# Altium schematic sheet DSI_LCD.SchDoc: 4 inch DSI LCD board
size A4; Date: 9/24/2014; Author: P.A.; CompanyName: STMicroelectronics; Organization: Microcontrollers Division; Address1: 12, Rue Jules HOROWITZ; Address2: 38019 Grenoble; Address3: FRANCE; DocumentNumber: MB1189; Revision: B-07; SheetNumber: 7; SheetTotal: 12; Project: STM32F469I-DISCO
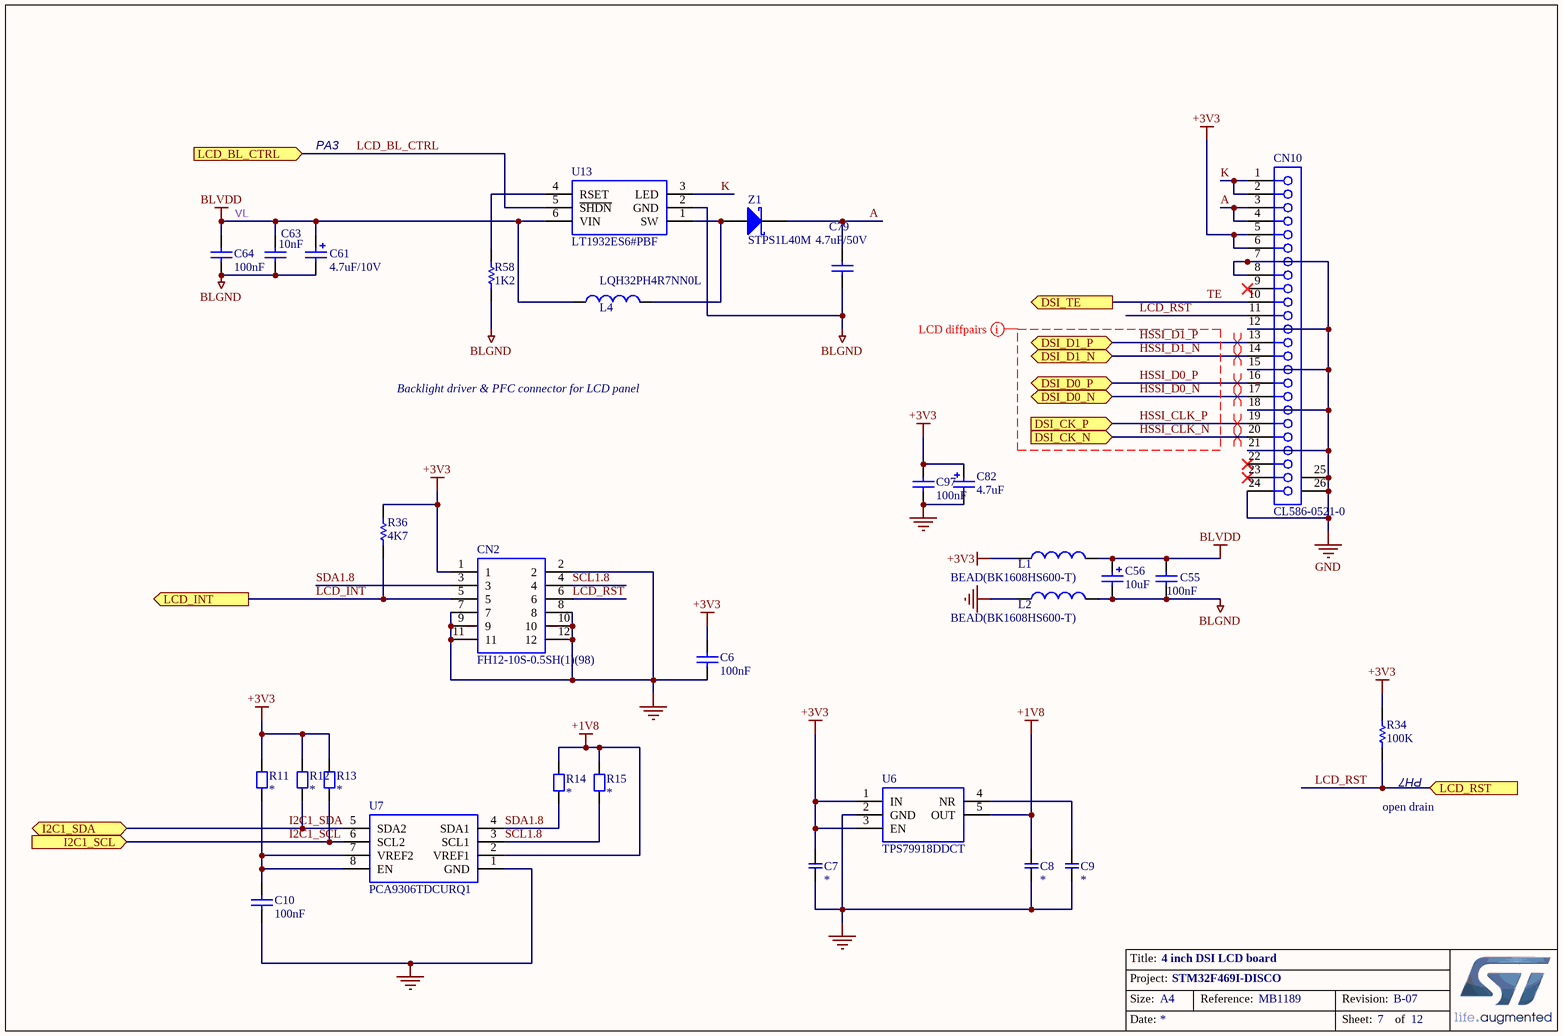
[diagram p0: DSI_LCD.SchDoc]

## Parts
C6  100nF  [CAP - 0402]
C7  100nF  [CAP - 0402]  (value not drawn)
C8  2.2uF  [CAP - 0402]  (value not drawn)
C9  10uF  [CAP - 0402]  (value not drawn)
C10  100nF  [CAP - 0402]
C55  100nF  [CAP - 0402]
C56  10uF  [A]
C61  4.7uF/10V  [CAP - 1206]
C63  10nF  [CAP - 0402]
C64  100nF  [CAP - 0402]
C79  4.7uF/50V  [CAP - 1206]
C82  4.7uF  [A]
C97  100nF  [CAP - 0402]
CN2  FH12-10S-0.5SH(1)(98)  [FH1210S05SH198]
CN10  CL586-0521-0  [FH12-24S-0.5SH]
L1  BEAD(BK1608HS600-T)  [1608[0603]]
L2  BEAD(BK1608HS600-T)  [1608[0603]]
L4  LQH32PH4R7NN0L  [C1210_L]
R11  200K  [RES - 0402]  (value not drawn)
R12  2K7  [RES - 0402]  (value not drawn)
R13  2K7  [RES - 0402]  (value not drawn)
R14  1K5  [RES - 0402]  (value not drawn)
R15  1K5  [RES - 0402]  (value not drawn)
R34  100K  [RES - 0402]
R36  4K7  [RES - 0402]
R58  1K2  [RES - 0402]
U6  TPS79918DDCT  [SOT95P280X110-5N]
U7  PCA9306TDCURQ1  [SOP50P310X90-8N]
U13  LT1932ES6#PBF  [SOT95P280X145-6N]
Z1  STPS1L40M  [DO-216AA]

## Ports
DSI_CK_N (in), DSI_CK_P (in), DSI_D0_N (bidir), DSI_D0_P (bidir), DSI_D1_N (bidir), DSI_D1_P (bidir), DSI_TE (out), I2C1_SCL (in), I2C1_SDA (bidir), LCD_BL_CTRL (in), LCD_INT (out), LCD_RST (in)

## Nets
+1V8: C8.2 R14.2 R15.2 U6.5(OUT) U7.2(VREF1)
+3V3: C6.2 C7.2 C82.1 C97.2 CN2.1 CN10.5 CN10.6 L1.1 R11.2 R12.2 R13.2 R34.1 R36.1 U6.1(IN) U6.3(EN)
BLGND: C55.2 C56.2 C61.2 C63.1 C64.1 C79.2 L2.2 R58.1 U13.2(GND)
GND: C6.1 C7.1 C8.1 C9.1 C10.1 C82.2 C97.1 CN2.2 CN2.7 CN2.8 CN2.9 CN2.10 CN2.11 CN2.12 CN10.7 CN10.8 CN10.12 CN10.15 CN10.18 CN10.21 CN10.24 CN10.25(MH1) CN10.26(MH2) L2.1 U6.2(GND) U7.1(GND)
VL: C55.1 C56.1 C61.1 C63.2 C64.2 L1.2 L4.1 U13.6(VIN)  [also labelled BLVDD]
A: C79.1 CN10.3 CN10.4 Z1.2(K)
HSSI_CLK_N: CN10.20 ; port DSI_CK_N
HSSI_CLK_P: CN10.19 ; port DSI_CK_P
HSSI_D0_N: CN10.17 ; port DSI_D0_N
HSSI_D0_P: CN10.16 ; port DSI_D0_P
HSSI_D1_N: CN10.14 ; port DSI_D1_N
HSSI_D1_P: CN10.13 ; port DSI_D1_P
I2C1_SCL: R13.1 U7.6(SCL2) ; port I2C1_SCL
I2C1_SDA: R12.1 U7.5(SDA2) ; port I2C1_SDA
K: CN10.1 CN10.2 U13.3(LED)
LCD_BL_CTRL: U13.5(~{SHDN}) ; port LCD_BL_CTRL
LCD_INT: CN2.5 R36.2 ; port LCD_INT
LCD_RST: CN2.6 CN10.11 R34.2 ; port LCD_RST
SCL1.8: CN2.4 R15.1 U7.3(SCL1)
SDA1.8: CN2.3 R14.1 U7.4(SDA1)
TE: CN10.10 ; port DSI_TE
NetC9_2: C9.2 U6.4(NR)
NetC10_2: C10.2 R11.1 U7.7(VREF2) U7.8(EN)
NetL4_2: L4.2 U13.1(SW) Z1.1(A)
NetR58_2: R58.2 U13.4(RSET)

Not connected (* = marked no-connect by the designer): CN10 9* 22* 23*

## Layout directives
differential pair: HSSI_CLK_N, HSSI_CLK_P, HSSI_D0_N, HSSI_D0_P, HSSI_D1_N, HSSI_D1_P
net class LCD: HSSI_CLK_N, HSSI_CLK_P, HSSI_D0_N, HSSI_D0_P, HSSI_D1_N, HSSI_D1_P

## Notes on the sheet
- PA3
- Backlight driver & PFC connector for LCD panel
- (near R34) PH7
- open drain
- Title:
- Project:
- Size:
- Date:
- A4
- Reference:
- Sheet:
- Revision:
- of

## Library data of the parts
C6 C10 C63 C64 C79 C97 = CAP: Capacitor; Value: 100pF; Ordered by: Subcon; Published: 8-Jun-2000; Revision: July-2002: Re-released for DXP Platform.; Publisher: Altium Limited
C7-C9 = capacitor: Parameter 1: *; Parameter 2: *; Value: *
C55 = Cap: Capacitor; Value: 10nF; Ordered by: Subcon; Published: 8-Jun-2000; Revision: July-2002: Re-released for DXP Platform.; Publisher: Altium Limited
C56 = Cap Pol1: Polarized Capacitor (Radial); Ordered by: Subcon; Published: 8-Jun-2000; Revision: July-2002: Re-released for DXP Platform.; Publisher: Altium Limited; Value: 10uF
C61 C82 = Cap Pol1: Polarized Capacitor (Radial); Value: 100pF; Ordered by: Subcon; Published: 8-Jun-2000; Revision: July-2002: Re-released for DXP Platform.; Publisher: Altium Limited
CN2 = FH12-10S-0.5SH(1)(98): FFC & FPC Connectors 10P SMT HORIZONTAL .5MM PITCH; Manufacturer_Name: Hirose; Geometry.Height: 2mm; Manufacturer_Part_Number: FH12-10S-0.5SH(1)(98); RS Part Number: *; RS Price/Stock: *; Arrow Part Number: FH12-10S-0.5SH(1)(98); Arrow Price/Stock: *; Datasheet Link: https://www.hirose.com/product/en/download_file/key_name/FH12-10S-0.5SH%281%29%2898%29/category/Drawing%20(2D)/doc_file_id/144497/?file_category_id=6&item_id=05280003598&is_series=
CN10 = CL586-0521-0: FH12 Series, "Flip-Lock" SMT/ZIF FFC/FPC Connector - 0.5mm Spaced Bottom Contact; Positions: 24; ContactMaterial: Phosphor Bronze; Current: 0.4A; PCB_Layout: Complies with manufacturer's recommendation.; Published: 17-Jul-2002; DatasheetVersion: 13-Nov-2000; PackageVersion: 13-Nov-2000; PackageReference: FH12-24S-0.5SH; Publisher: Altium Limited; PadDimensions: Follow nominal values, Suitable for Wave Soldering, Adjust for Re-flow.; ComponentLink1Description: Manufacturer Link; ComponentLink1URL: http://www.hiroseusa.com/; ComponentLink2Description: Datasheet; ComponentLink2URL: http://www.hirose.co.jp/cataloge_hp/e58605370.pdf
L1 L2 L4 = Inductor: Value: 100uH; Ordered by: Subcon; Published: 8-Jun-2000; Revision: July-2002: Re-released for DXP Platform.; Publisher: Altium Limited
R11-R15 = resistor: Parameter 1: *; Parameter 2: *; Value: *
R34 R36 R58 = Res1: Resistor; Value: 1K; Ordered by: Subcon; Published: 8-Jun-2000; Revision: July-2002: Re-released for DXP Platform.; Publisher: Altium Limited
U6 = TPS79918DDCT: TPS79918DDCT, Low Dropout Voltage Regulator, 0.2A, 1.8V 1%, 2.7 to 6.5Vin, 5-Pin SOT; Manufacturer_Name: Texas Instruments; Geometry.Height: 1.1mm; Manufacturer_Part_Number: TPS79918DDCT; RS Part Number: 1455973; RS Price/Stock: http://uk.rs-online.com/web/p/products/1455973; Mouser Part Number: 595-TPS79918DDCT; Mouser Price/Stock: https://www.mouser.com/Search/Refine.aspx?Keyword=595-TPS79918DDCT; Datasheet Link: http://www.ti.com/lit/ds/symlink/tps79918.pdf
U7 = PCA9306TDCURQ1: Automotive Dual Bidirectional I2C Bus and SMBus Voltage-Level Translator; Manufacturer_Name: Texas Instruments; Geometry.Height: 0.9mm; Manufacturer_Part_Number: PCA9306TDCURQ1; RS Part Number: *; RS Price/Stock: *; Mouser Part Number: 595-PCA9306TDCURQ1; Mouser Price/Stock: https://www.mouser.com/Search/Refine.aspx?Keyword=595-PCA9306TDCURQ1; Datasheet Link: http://www.ti.com/lit/gpn/pca9306-q1
U13 = LT1932ES6#PBF: LINEAR TECHNOLOGY - LT1932ES6#PBF - IC, DC/DC CONVERT/LED DR, 6SOT2; Geometry.Height: 1.45mm; Manufacturer_Name: Linear Technology; Manufacturer_Part_Number: LT1932ES6#PBF; RS Part Number: *; RS Price/Stock: *; Mouser Part Number: 584-LT1932ES6#PBF; Mouser Price/Stock: https://www.mouser.com/Search/Refine.aspx?Keyword=584-LT1932ES6%23PBF; Datasheet Link: http://www.linear.com/docs/2139
Z1 = D Schottky: Schottky Diode; Code - JEDEC: DO-214-AA; Ordered by: ST; Ref St: 9151085; ECCN_US/EU: EAR99/NEC; Published: 8-Jun-2000; Revision: July-2002: Re-released for DXP Platform.; Publisher: Altium Limited; Manuf_1: ST; Manuf_Part_1: STPS1L40M